# EAGLE schematic AlimentationLabo-Debutant (EAGLE 8.3.1)
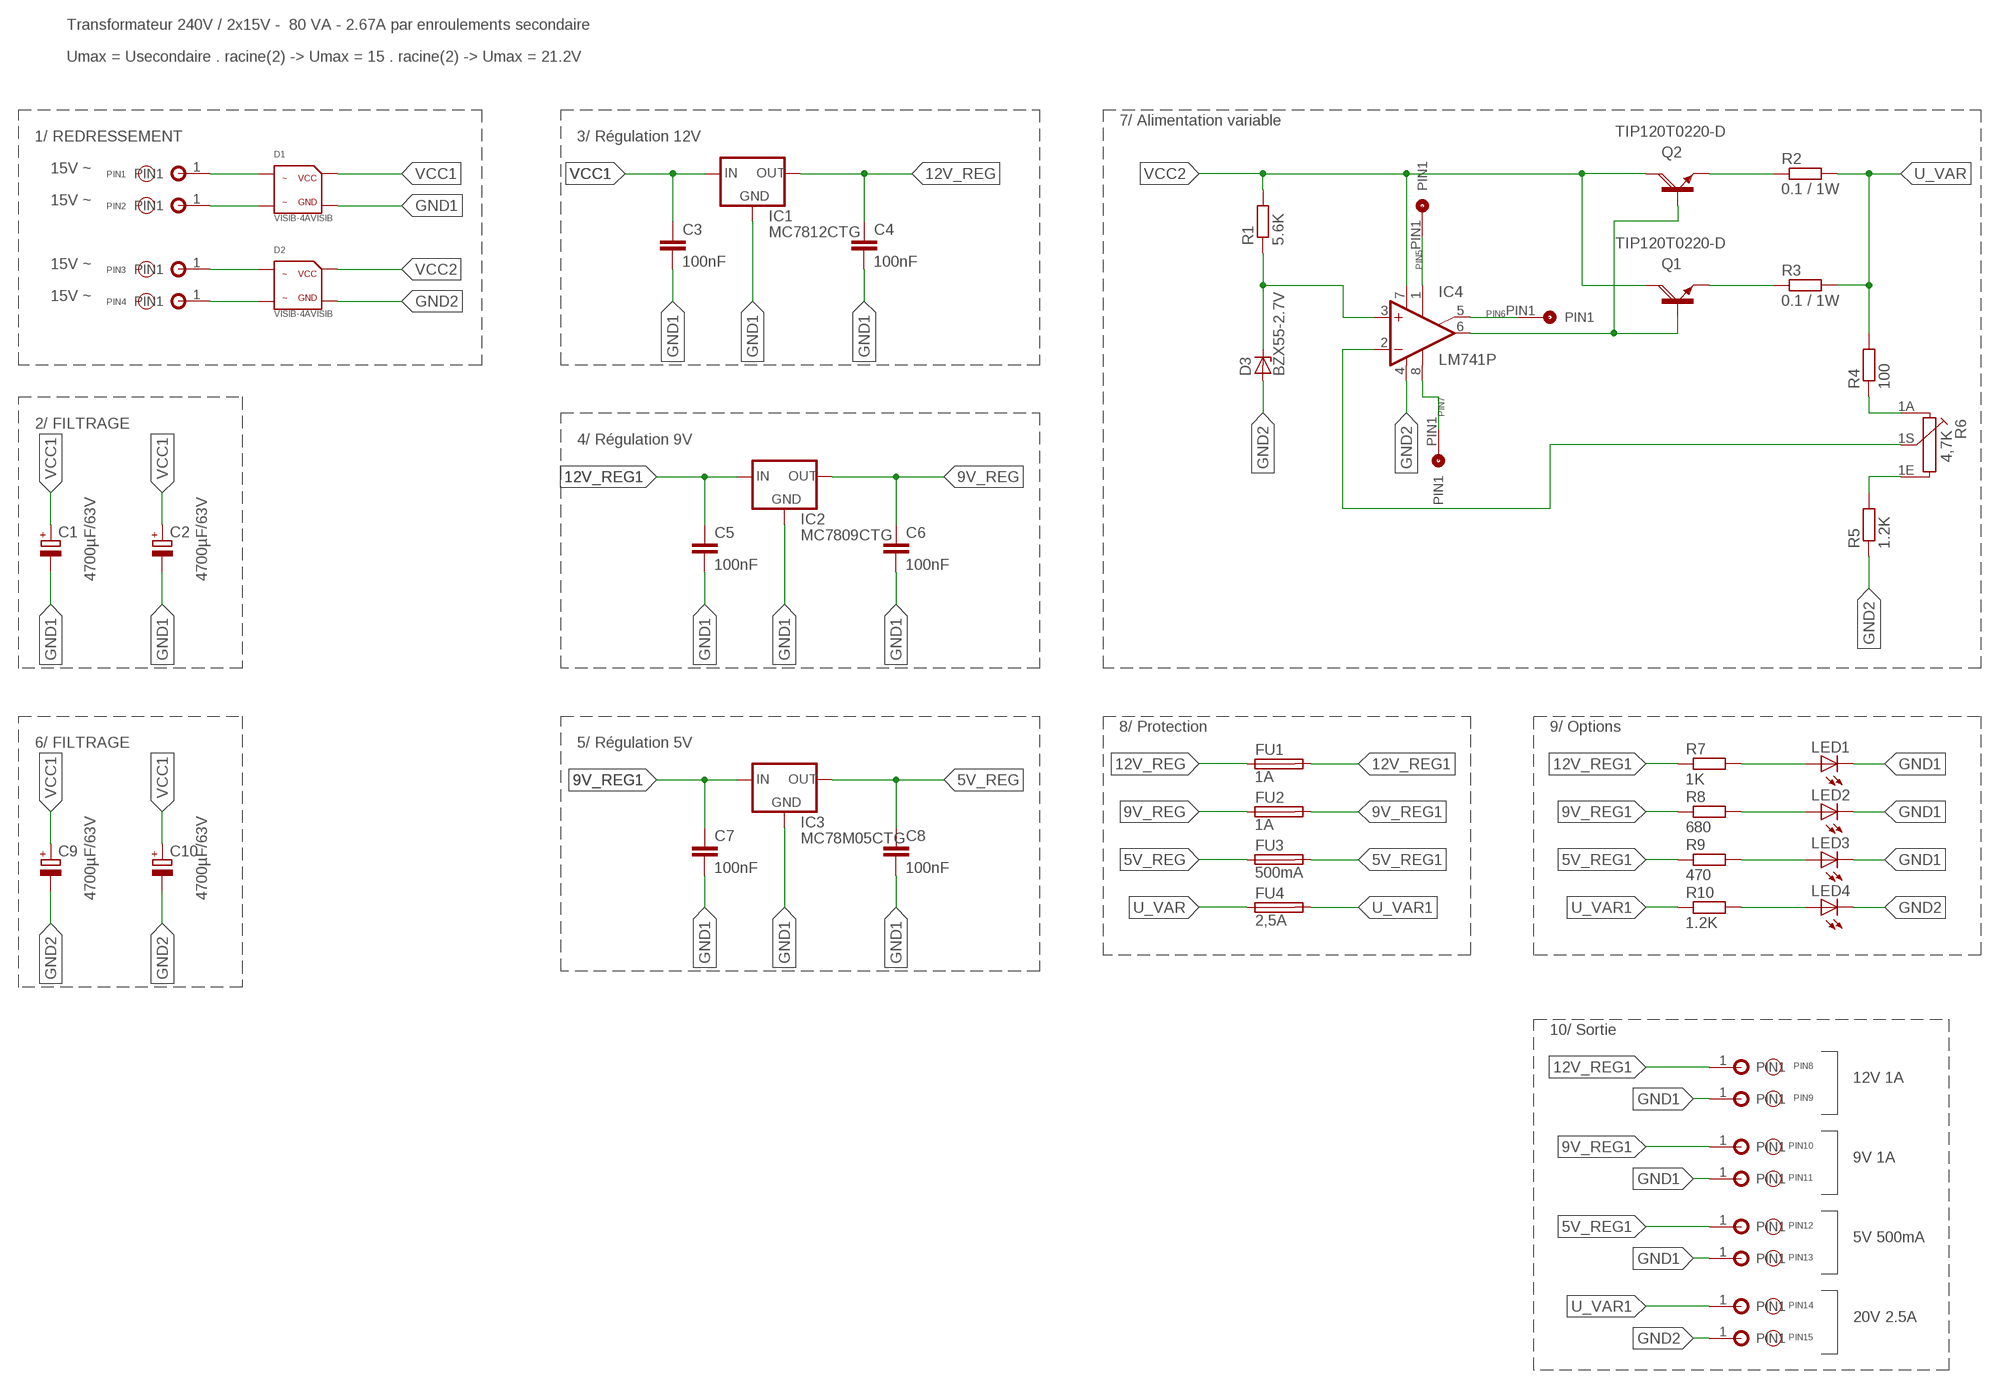
[diagram p0: schematic, sheet 1]

## Parts
C1  4700µF/63V  CPOL-EUE10-25  [EB25D]
C2  4700µF/63V  CPOL-EUE10-25  [EB25D]
C3  100nF  C-EUC0805  [C0805]
C4  100nF  C-EUC0805  [C0805]
C5  100nF  C-EUC0805  [C0805]
C6  100nF  C-EUC0805  [C0805]
C7  100nF  C-EUC0805  [C0805]
C8  100nF  C-EUC0805  [C0805]
C9  4700µF/63V  CPOL-EUE10-25  [EB25D]
C10  4700µF/63V  CPOL-EUE10-25  [EB25D]
D1  VISIB-4AVISIB  [VISIB-4A]
D2  VISIB-4AVISIB  [VISIB-4A]
D3  BZX55-2.7V  BZX55  [DO35Z10]
FU1  1A  MC36226SMD1812  [MC36226]
FU2  1A  MC36226SMD1812  [MC36226]
FU3  500mA  MC36226SMD1812  [MC36226]
FU4  2,5A  MC36226SMD1812  [MC36226]
IC1  MC7812CTG  78XXS  [78XXS]
IC2  MC7809CTG  78XXS  [78XXS]
IC3  MC78M05CTG  78XXS  [78XXS]
IC4  LM741P  [DIL08]
LED1  LED5MM  [LED5MM]
LED2  LED5MM  [LED5MM]
LED3  LED5MM  [LED5MM]
LED4  LED5MM  [LED5MM]
PIN1  CON-FILTRAVERSANT-1PIN  [CON-FILTRAVERSANT-T2]
PIN2  CON-FILTRAVERSANT-1PIN  [CON-FILTRAVERSANT-T2]
PIN3  CON-FILTRAVERSANT-1PIN  [CON-FILTRAVERSANT-T2]
PIN4  CON-FILTRAVERSANT-1PIN  [CON-FILTRAVERSANT-T2]
PIN5  CON-TRAV-1PIN  [CON-TRAV-1]
PIN6  CON-TRAV-1PIN  [CON-TRAV-1]
PIN7  CON-TRAV-1PIN  [CON-TRAV-1]
PIN8  CON-FILTRAVERSANT-1PIN  [CON-FILTRAVERSANT-T2]
PIN9  CON-FILTRAVERSANT-1PIN  [CON-FILTRAVERSANT-T2]
PIN10  CON-FILTRAVERSANT-1PIN  [CON-FILTRAVERSANT-T2]
PIN11  CON-FILTRAVERSANT-1PIN  [CON-FILTRAVERSANT-T2]
PIN12  CON-FILTRAVERSANT-1PIN  [CON-FILTRAVERSANT-T2]
PIN13  CON-FILTRAVERSANT-1PIN  [CON-FILTRAVERSANT-T2]
PIN14  CON-FILTRAVERSANT-1PIN  [CON-FILTRAVERSANT-T2]
PIN15  CON-FILTRAVERSANT-1PIN  [CON-FILTRAVERSANT-T2]
Q1  TIP120T0220-D  [T0220-D]
Q2  TIP120T0220-D  [T0220-D]
R1  5.6K  R-EU_R0805  [R0805]
R2  0.1 / 1W  R-EU_0817/22  [P0817/22]
R3  0.1 / 1W  R-EU_0817/22  [P0817/22]
R4  100  R-EU_R0805  [R0805]
R5  1.2K  R-EU_R0805  [R0805]
R6  4,7K  PC16S  [PC16S]
R7  1K  R-EU_R0805  [R0805]
R8  680  R-EU_R0805  [R0805]
R9  470  R-EU_R0805  [R0805]
R10  1.2K  R-EU_R0805  [R0805]

## Nets
5V_REG: C8.1 FU3.1 IC3.OUT
5V_REG1: FU3.2 PIN12.1(PIN1) R9.1
9V_REG: C6.1 FU2.1 IC2.OUT
9V_REG1: C7.1 FU2.2 IC3.IN PIN10.1(PIN1) R8.1
12V_REG: C4.1 FU1.1 IC1.OUT
12V_REG1: C5.1 FU1.2 IC2.IN PIN8.1(PIN1) R7.1
GND1: C1.- C2.- C3.2 C4.2 C5.2 C6.2 C7.2 C8.2 D1.GND IC1.GND IC2.GND IC3.GND LED1.K(C) LED2.K(C) LED3.K(C) PIN9.1(PIN1) PIN11.1(PIN1) PIN13.1(PIN1)
GND2: C9.- C10.- D2.GND D3.A IC4.4(V-) LED4.K(C) PIN15.1(PIN1) R5.1
N$1: D1.ALT1 PIN1.1(PIN1)
N$2: D1.ALT2 PIN2.1(PIN1)
N$3: D2.ALT1 PIN3.1(PIN1)
N$4: D2.ALT2 PIN4.1(PIN1)
N$5: Q2.E R2.1
N$6: Q1.E R3.1
N$7: IC4.6(OUT) Q1.B Q2.B
N$8: D3.C IC4.3(+IN) R1.1
N$9: IC4.8(OPT) PIN7.PIN1
N$10: LED1.A R7.2
N$11: R4.1 R6.1A
N$12: R5.2 R6.1E
N$13: IC4.5(ON2) PIN6.PIN1
N$14: IC4.1(ON1) PIN5.PIN1
N$15: IC4.2(-IN) R6.1S
N$16: LED2.A R8.2
N$17: LED3.A R9.2
N$18: LED4.A R10.2
U_VAR: FU4.1 R2.2 R3.2 R4.2
U_VAR1: FU4.2 PIN14.1(PIN1) R10.1
VCC1: C1.+ C2.+ C3.1 C9.+ C10.+ D1.VCC IC1.IN
VCC2: D2.VCC IC4.7(V+) Q1.C Q2.C R1.2

## Notes on the sheet
- Transformateur 240V / 2x15V -  80 VA - 2.67A par enroulements secondaire
- Umax = Usecondaire . racine(2) -> Umax = 15 . racine(2) -> Umax = 21.2V
- 7/ Alimentation variable
- 1/ REDRESSEMENT | 3/ Régulation 12V
- 15V ~
- 15V ~
- 15V ~
- 15V ~
- 2/ FILTRAGE
- 4/ Régulation 9V
- 8/ Protection | 9/ Options
- 6/ FILTRAGE | 5/ Régulation 5V
- 10/ Sortie
- 12V 1A
- 9V 1A
- 5V 500mA
- 20V 2.5A

## Library data of the parts
C1 C2 C9 C10 = rcl:CPOL-EU: POLARIZED CAPACITOR, European symbol
C3-C8 = rcl:C-EU: CAPACITOR, European symbol
D1 D2 = Alex-Diode-Redresseur:VISIB-4A
D3 = diode:BZX55: Z DIODE
FU1-FU4 = Alex-Poly:MC36226
IC1-IC3 = v-reg:78XXS: VOLTAGE REGULATOR
IC4 = linear:*741: OP AMP
LED1-LED4 = led:LED: LED OSRAM: - CHIPLED LG R971, LG N971, LY N971, LG Q971, LY Q971, LO R971, LY R971 LH N974, LH R974 LS Q976, LO Q976, LY Q976 LO Q996 - Hyper CHIPLED LW Q18S LB Q993, LB Q99A, LB R99A - SideLED LS A670, LO A670, LY A670, LG A670, LP A670 LB A673, LV A673, LT A673, LW A673 LH A674 LY A675 LS A676, LA A676, LO A676, LY A676, LW A676 LS A679, LY A679, LG A679 - Hyper Micro SIDELED® LS Y876, LA Y876, LO Y876, LY Y876 LT Y87S - SmartLED LW L88C, LW L88S LB L89C, LB L89S, LG L890 LS L89K, LO L89K, LY L89K LS L896, LA L896, LO L896, LY L896 - TOPLED LS T670, LO T670, LY T670, LG T670, LP T670 LSG T670, LSP T670, LSY T670, LOP T670, LYG T670 LG T671, LOG T671, LSG T671 LB T673, LV T673, LT T673, LW T673 LH T674 LS T676, LA T676, LO T676, LY T676, LB T676, LH T676, LSB T676, LW T676 LB T67C, LV T67C, LT T67C, LS T67K, LO T67K, LY T67K, LW E67C LS E67B, LA E67B, LO E67B, LY E67B, LB E67C, LV E67C, LT E67C LW T67C LS T679, LY T679, LG T679 LS T770, LO T770, LY T770, LG T770, LP T770 LB T773, LV T773, LT T773, LW T773 LH T774 LS E675, LA E675, LY E675, LS T675 LS T776, LA T776, LO T776, LY T776, LB T776 LHGB T686 LT T68C, LB T68C - Hyper Mini TOPLED® LB M676 - Mini TOPLED Santana® LG M470 LS M47K, LO M47K, LY M47K Source: http://www.osram.convergy.de LUXEON: - LUMILED® LXK2-PW12-R00, LXK2-PW12-S00, LXK2-PW14-U00, LXK2-PW14-V00 LXK2-PM12-R00, LXK2-PM12-S00, LXK2-PM14-U00 LXK2-PE12-Q00, LXK2-PE12-R00, LXK2-PE12-S00, LXK2-PE14-T00, LXK2-PE14-U00 LXK2-PB12-K00, LXK2-PB12-L00, LXK2-PB12-M00, LXK2-PB14-N00, LXK2-PB14-P00, LXK2-PB14-Q00 LXK2-PR12-L00, LXK2-PR12-M00, LXK2-PR14-Q00, LXK2-PR14-R00 LXK2-PD12-Q00, LXK2-PD12-R00, LXK2-PD12-S00 LXK2-PH12-R00, LXK2-PH12-S00 LXK2-PL12-P00, LXK2-PL12-Q00, LXK2-PL12-R00 Source: www.luxeon.com KINGBRIGHT: KA-3528ASYC Source: www.kingbright.com
PIN1-PIN4 PIN8-PIN15 = Pin:CON-FILTRAVERSANT-1
PIN5-PIN7 = Pin:CON-TRAV-1
Q1 Q2 = Alex-Transistor:TIP120: NPN DARLINGTON TRANSISTOR
R1-R5 R7-R10 = resistor:R-EU_: RESISTOR, European symbol
R6 = piher:PC16S: POTENTIOMETER single carbon potentiometer, 16 mm, S3ROH; OC_FARNELL: 4452940; OC_NEWARK: unknown